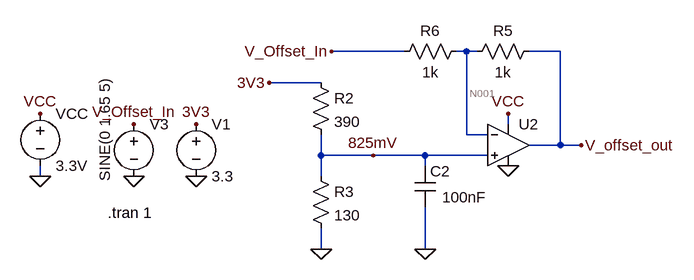
[diagram p0: schematic Offset.asc]
Offset.asc, the LTspice schematic file:
Version 4
SHEET 1 1828 680
WIRE 384 48 272 48
WIRE 480 48 464 48
WIRE 496 48 480 48
WIRE 624 48 576 48
WIRE 256 96 176 96
WIRE 544 160 544 144
WIRE 480 176 480 48
WIRE 512 176 480 176
WIRE 624 192 624 48
WIRE 624 192 576 192
WIRE 656 192 624 192
WIRE 256 208 256 176
WIRE 336 208 256 208
WIRE 416 208 336 208
WIRE 512 208 416 208
WIRE 416 224 416 208
WIRE -176 240 -176 224
WIRE 256 240 256 208
WIRE 256 352 256 320
WIRE 416 352 416 288
FLAG 256 352 0
FLAG 176 96 3V3
FLAG 336 208 825mV
FLAG 544 224 0
FLAG -176 240 0
FLAG -176 144 VCC
FLAG 544 144 VCC
FLAG -32 160 V_Offset_In
FLAG 656 192 V_offset_out
FLAG 272 48 V_Offset_In
FLAG -32 240 0
FLAG 416 352 0
FLAG 64 240 0
FLAG 64 160 3V3
SYMBOL res 240 80 R0
SYMATTR InstName R2
SYMATTR Value 390
SYMBOL res 240 224 R0
SYMATTR InstName R3
SYMATTR Value 130
SYMBOL voltage -176 128 R0
WINDOW 123 0 0 Left 0
WINDOW 39 0 0 Left 0
SYMATTR InstName VCC
SYMATTR Value 3.3V
SYMBOL voltage -32 144 R0
WINDOW 3 -45 104 VLeft 2
WINDOW 123 0 0 Left 0
WINDOW 39 0 0 Left 0
SYMATTR Value SINE(0 1.65 5)
SYMATTR InstName V3
SYMBOL res 592 32 R90
WINDOW 0 0 56 VBottom 2
WINDOW 3 32 56 VTop 2
SYMATTR InstName R5
SYMATTR Value 1k
SYMBOL res 480 32 R90
WINDOW 0 0 56 VBottom 2
WINDOW 3 32 56 VTop 2
SYMATTR InstName R6
SYMATTR Value 1k
SYMBOL OpAmps\\UniversalOpAmp2 544 192 R0
SYMATTR InstName U2
SYMBOL cap 400 224 R0
WINDOW 3 42 48 Left 2
SYMATTR Value 100nF
SYMATTR InstName C2
SYMBOL voltage 64 144 R0
WINDOW 123 0 0 Left 0
WINDOW 39 0 0 Left 0
SYMATTR InstName V1
SYMATTR Value 3.3
TEXT -72 296 Left 2 !.tran 1

The netlist it stands for:
* Offset.asc
R2 3V3 825mV 390
R3 825mV 0 130
VCC VCC 0 3.3V
V3 V_Offset_In 0 SINE(0 1.65 5)
R5 V_offset_out N001 1k
R6 N001 V_Offset_In 1k
XU2 825mV N001 VCC 0 V_offset_out level2 Avol=1Meg GBW=10Meg Slew=10Meg Ilimit=25m Rail=0 Vos=0 En=0 Enk=0 In=0 Ink=0 Rin=500Meg  ; pins In+ In- V+ V- OUT
C2 825mV 0 100nF
V1 3V3 0 3.3
.tran 1
.lib UniversalOpAmp2.lib
.backanno
.end

* Results of the author's LTspice run, read from the files saved beside the schematic
* Operating Point, zero values left out:
*   V(3v3) = 3.3 V
*   V(825mv) = 825 mV
*   V(vcc) = 3.3 V
*   V(v_offset_out) = 1.65 V
*   V(n001) = 825 mV
*   I(R2) = 6.346 mA
*   I(R3) = 6.346 mA
*   I(R5) = 825 µA
*   I(R6) = 825 µA
*   I(Vcc) = -856.8 µA
*   I(V3) = 825 µA
*   I(V1) = -6.346 mA
*   Ix(u2:1) = -1.65 nA
*   Ix(u2:2) = -1.65 nA
*   Ix(u2:3) = 856.8 µA
*   Ix(u2:4) = -31.77 µA
*   Ix(u2:5) = -825 µA
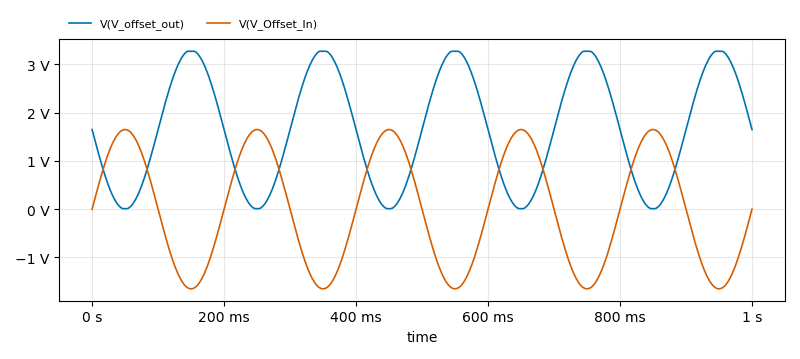
[diagram p1: Transient Analysis of Offset.asc, plotted from the saved traces]
* Transient Analysis, 1 run:
*   V(V_offset_out): min 10.03 mV, max 3.272 V, average 1.649 V, rms 2.019 V, last 1.65 V
*   V(V_Offset_In): min -1.65 V, max 1.65 V, average 119.9 µV, rms 1.167 V, last 0 V